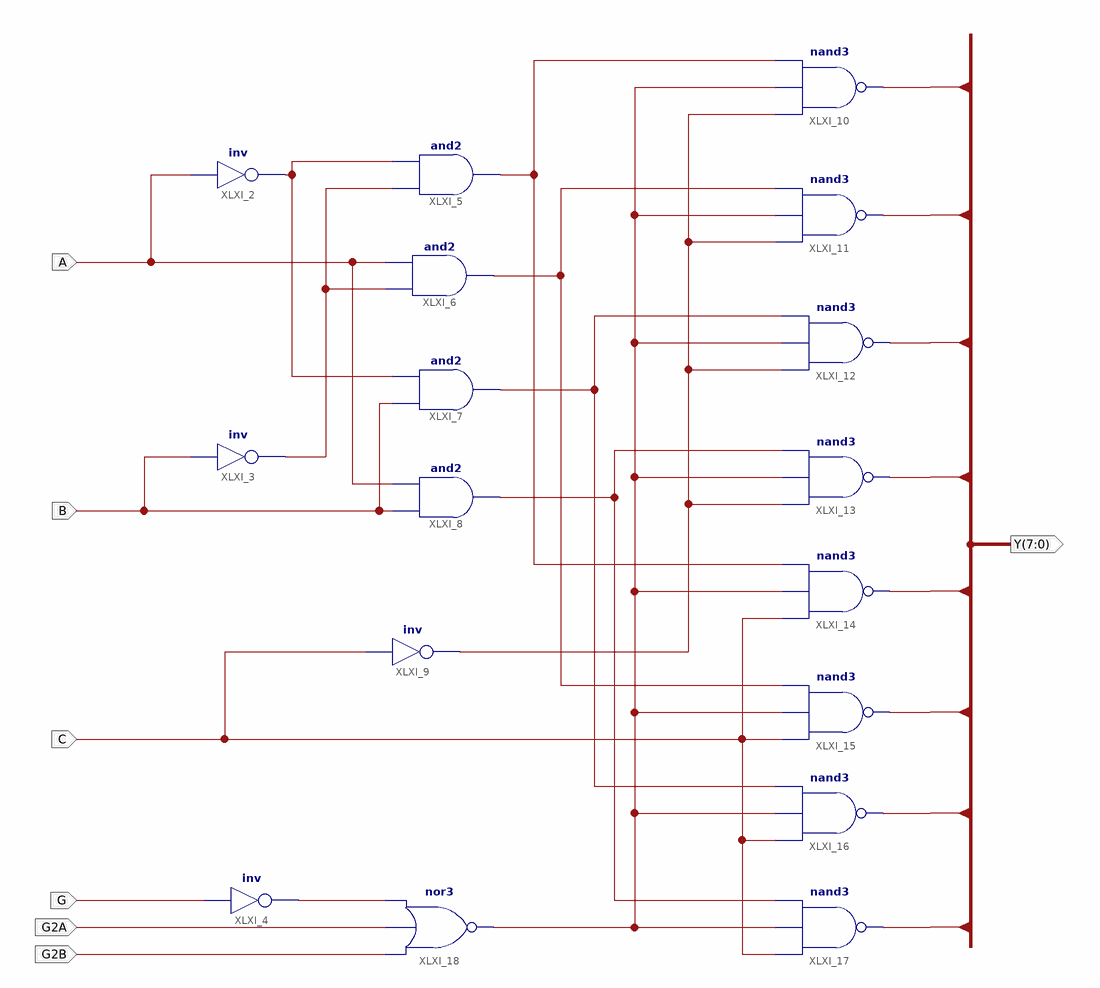
[diagram p0: schematic sheet 1]
// Xilinx ISE schematic D_74LS138.sch (kintex7) as structural Verilog: 17 symbols, 7 ports
module D_74LS138 (
  input  B,
  input  A,
  input  G,
  input  G2A,
  input  G2B,
  input  C,
  output [7:0] Y
);

  wire XLXN_15, XLXN_21, XLXN_32, XLXN_34, XLXN_38, XLXN_41, XLXN_43, XLXN_53, XLXN_83;

  not XLXI_2 (XLXN_15, A);
  not XLXI_3 (XLXN_21, B);
  and XLXI_5 (XLXN_32, XLXN_21, XLXN_15);
  and XLXI_6 (XLXN_34, XLXN_21, A);
  and XLXI_7 (XLXN_38, B, XLXN_15);
  and XLXI_8 (XLXN_41, B, A);
  nand XLXI_10 (Y[0], XLXN_83, XLXN_53, XLXN_32);
  nand XLXI_11 (Y[1], XLXN_83, XLXN_53, XLXN_34);
  nand XLXI_12 (Y[2], XLXN_83, XLXN_53, XLXN_38);
  nand XLXI_13 (Y[3], XLXN_83, XLXN_53, XLXN_41);
  nand XLXI_14 (Y[4], C, XLXN_53, XLXN_32);
  nand XLXI_15 (Y[5], C, XLXN_53, XLXN_34);
  nand XLXI_16 (Y[6], C, XLXN_53, XLXN_38);
  nand XLXI_17 (Y[7], C, XLXN_53, XLXN_41);
  nor XLXI_18 (XLXN_53, G2B, G2A, XLXN_43);
  not XLXI_4 (XLXN_43, G);
  not XLXI_9 (XLXN_83, C);
endmodule
